# EasyEDA Pro project ProProject_keyboard_Tassel43_2024-03-30.epro, board Tassel43_Without_RGB_Left
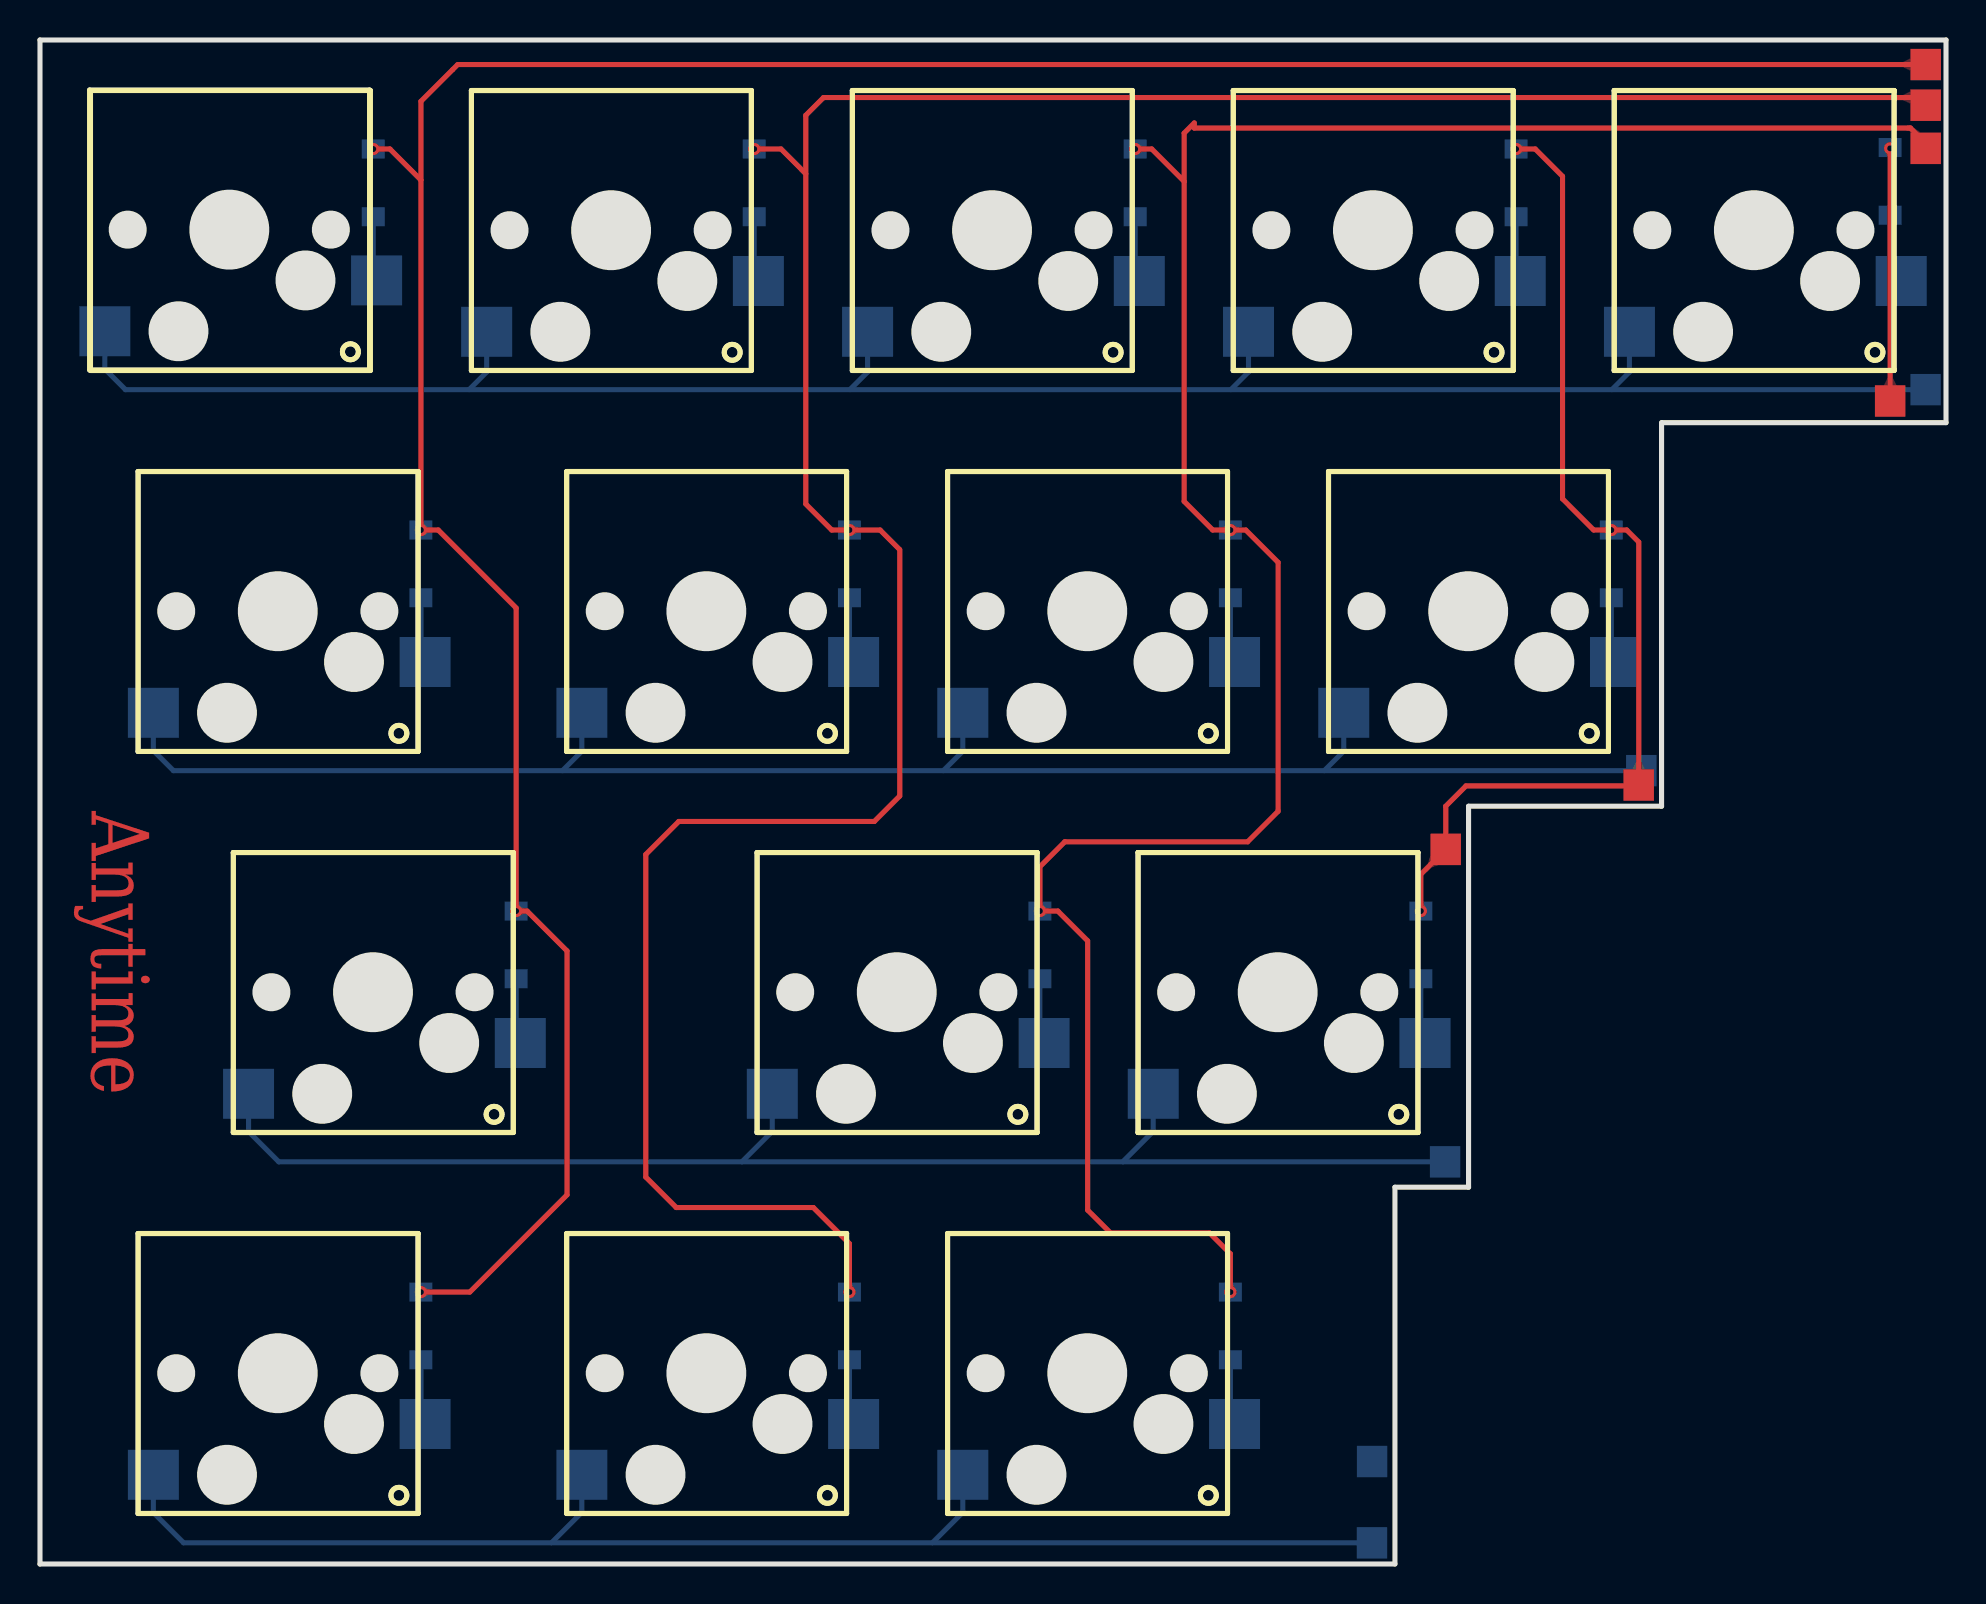
[diagram p13: board, top side]
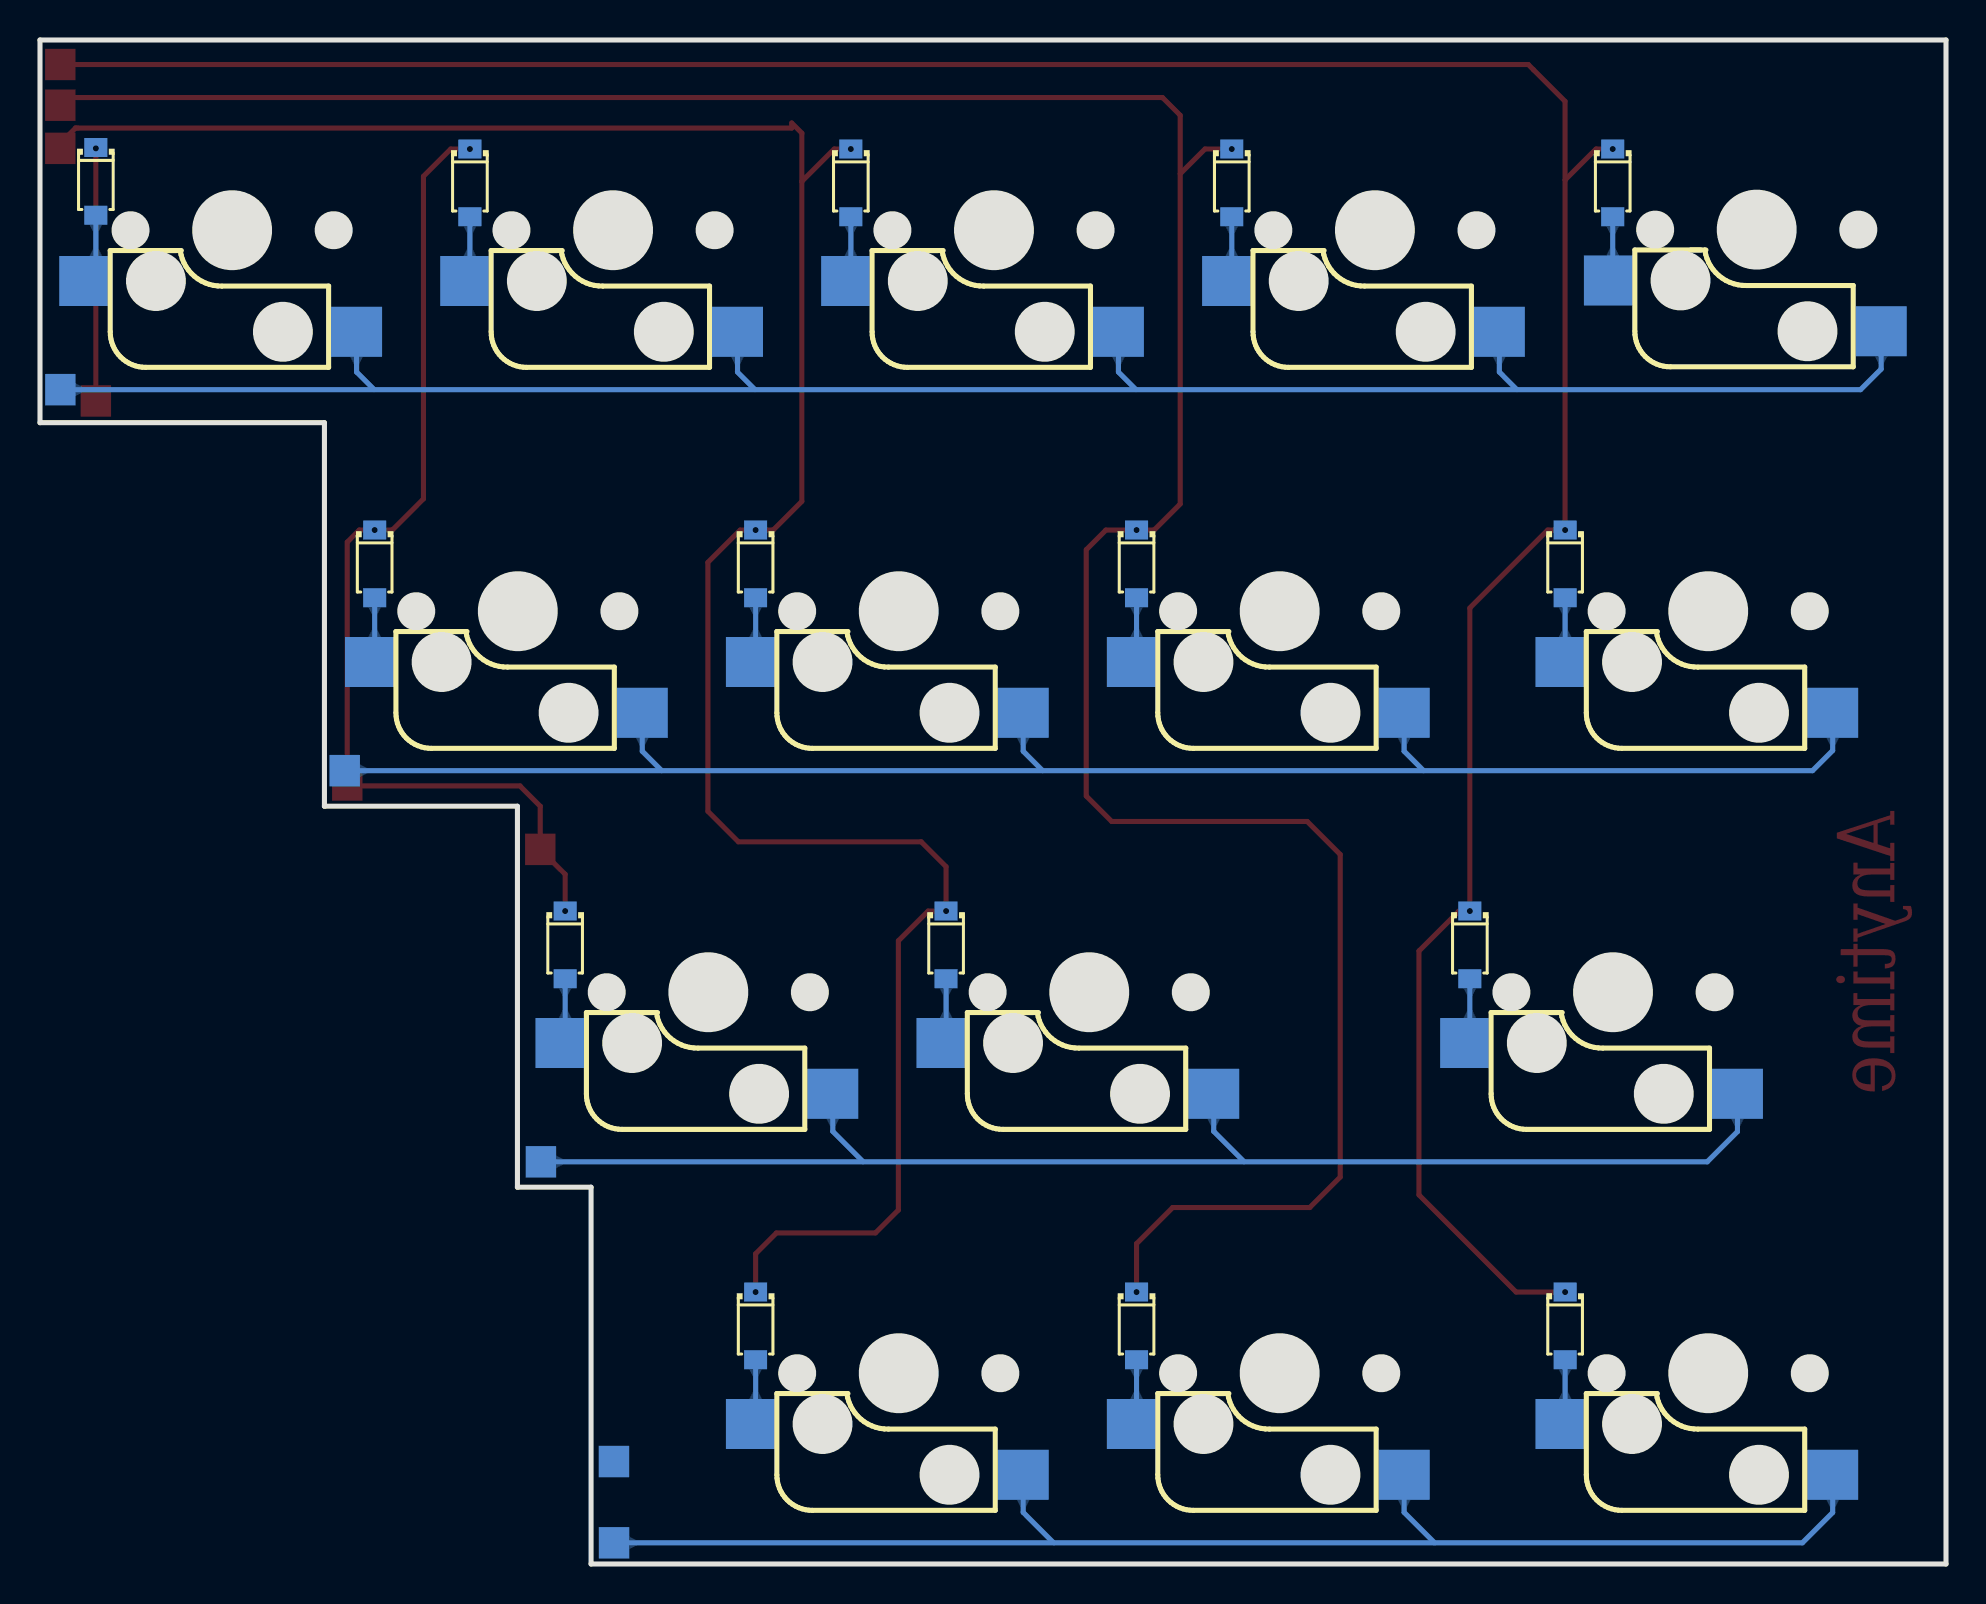
[diagram p14: board, bottom side, seen from below]

Outline 95.32 x 76.2 mm; copper layers: Top Layer, Bottom Layer. Coordinates in mm from the lower left corner of the outline.
Outline path: 0,76.2 95.32,76.2 95.32,57.07 81.09,57.07 81.09,37.89 71.44,37.89 71.44,18.84 67.76,18.84 67.76,0 0,0 0,76.2
Stack: Top Layer 0.035mm / Dielectric1 1.51mm FR4 er 4.5 / Bottom Layer 0.035mm

## Design rules (mm)
spacing Default (default): track to track 0.152, other pairs 0 to 0.152
track width Default (default): min 0.254, default 0.254, max 25.4
differential pair differentialPair (default): width min 0.127, default 0.254, max 2.54; gap min 0.152, default 0.152
via Default (default): diameter min 0.61, default 0.61, max 100.025; hole min 0.305, default 0.305, max 59.995
net GND uses gge57133(1)
pour e605 uses gge57133
pour e606 uses gge57133(1)

## Placement (name value [footprint] x y rotation side)
A  -  [凯华热插拨]  33.32 47.64 0 top
CAP  -  [凯华热插拨]  16.65 28.59 0 top
D  -  [凯华热插拨]  71.42 47.64 0 top
D14  1N4148W  [SOD-123_L2.8-W1.8-LS3.7-RD]  19.05 11.9 270 bottom
D35  1N4148W  [SOD-123_L2.8-W1.8-LS3.7-RD]  40.48 11.9 270 bottom
D41  1N4148W  [SOD-123_L2.8-W1.8-LS3.7-RD]  59.53 11.9 270 bottom
D53  1N4148W  [SOD-123_L2.8-W1.8-LS3.7-RD]  23.81 30.96 270 bottom
D54  1N4148W  [SOD-123_L2.8-W1.8-LS3.7-RD]  50.01 30.96 270 bottom
D55  1N4148W  [SOD-123_L2.8-W1.8-LS3.7-RD]  69.06 30.96 270 bottom
D64  1N4148W  [SOD-123_L2.8-W1.8-LS3.7-RD]  19.05 50.01 270 bottom
D65  1N4148W  [SOD-123_L2.8-W1.8-LS3.7-RD]  40.48 50.01 270 bottom
D66  1N4148W  [SOD-123_L2.8-W1.8-LS3.7-RD]  59.53 50.01 270 bottom
D68  1N4148W  [SOD-123_L2.8-W1.8-LS3.7-RD]  78.58 50.01 270 bottom
D83  1N4148W  [SOD-123_L2.8-W1.8-LS3.7-RD]  92.52 69.13 270 bottom
D84  1N4148W  [SOD-123_L2.8-W1.8-LS3.7-RD]  73.82 69.06 270 bottom
D85  1N4148W  [SOD-123_L2.8-W1.8-LS3.7-RD]  54.77 69.06 270 bottom
D86  1N4148W  [SOD-123_L2.8-W1.8-LS3.7-RD]  35.72 69.06 270 bottom
D87  1N4148W  [SOD-123_L2.8-W1.8-LS3.7-RD]  16.67 69.06 270 bottom
E  -  [凯华热插拨]  66.66 66.69 0 top
ESC  -  [凯华热插拨]  9.47 66.72 0 top
LCTRL  -  [凯华热插拨]  11.89 9.54 0 top
LGUI  -  [凯华热插拨]  33.32 9.54 0 top
LGUI1  -  [凯华热插拨]  52.37 9.54 0 top
NOREF  -  [Pad_e279]  94.3 58.72 0 top
NOREF#2  -  [Pad_e281]  70.27 20.11 0 top
NOREF#3  -  [Pad_e604]  70.3 35.73 0 top
NOREF#4  -  [Pad_e601]  94.3 70.78 0 top
NOREF#5  -  [Pad_e602]  92.52 58.15 0 top
NOREF#6  -  [Pad_e140]  66.62 5.12 0 top
NOREF#7  -  [Pad_e600]  94.3 72.94 0 top
NOREF#8  -  [Pad_e599]  94.3 74.97 0 top
NOREF#9  -  [Pad_e282]  66.61 1.06 0 top
NOREF#10  -  [Pad_e280]  80.08 39.67 0 top
NOREF#11  -  [Pad_e603]  79.95 38.95 0 top
Q  -  [凯华热插拨]  28.56 66.69 0 top
R  -  [凯华热插拨]  85.71 66.69 0 top
S  -  [凯华热插拨]  52.37 47.64 0 top
TAB  -  [凯华热插拨]  11.89 47.64 0 top
W  -  [凯华热插拨]  47.61 66.69 0 top
X  -  [凯华热插拨]  61.9 28.59 0 top
Z  -  [凯华热插拨]  42.85 28.59 0 top

## Footprints (pads in the part's own frame, mm; a bottom-side part is the same pattern mirrored in y, then rotated)
Pad_e140
  rect 1.52x1.57 smd far side: 22(0,0)
Pad_e279
  rect 1.52x1.57 smd far side: 14(0,0)
Pad_e280
  rect 1.52x1.57 smd far side: 21(0,0)
Pad_e281
  rect 1.52x1.57 smd far side: 22(0,0)
Pad_e282
  rect 1.52x1.57 smd far side: 24(0,0)
Pad_e599
  rect 1.52x1.57 smd: 6(0,0)
Pad_e600
  rect 1.52x1.57 smd: 7(0,0)
Pad_e601
  rect 1.52x1.57 smd: 9(0,0)
Pad_e602
  rect 1.52x1.57 smd: 16(0,0)
Pad_e603
  rect 1.52x1.57 smd: 18(0,0)
Pad_e604
  rect 1.52x1.57 smd: 26(0,0)
SOD-123_L2.8-W1.8-LS3.7-RD
  rect 0.95x1.15 smd: 1(-1.692,0) 2(1.692,0)
凯华热插拨
  rect 2.55x2.5 smd far side: K1(-6.223,-5.08) K2(7.366,-2.54)

## Nets
GND: NOREF#6.22
A1_4: A.K2 D65.2
COL0: D14.1 D53.1 D64.1 D87.1 NOREF#8.6
COL1: D35.1 D65.1 D86.1 NOREF#7.7
COL2: D41.1 D54.1 D66.1 D85.1 NOREF#4.9
COL3: D55.1 D68.1 D84.1 NOREF#3.26 NOREF#11.18
COL4: D83.1 NOREF#5.16
D14_2: D14.2 LCTRL.K2
D53_2: CAP.K2 D53.2
D64_2: D64.2 TAB.K2
D67_4: D.K2 D68.2
D83_2: D83.2 R.K2
D84_2: D84.2 E.K2
D85_2: D85.2 W.K2
D86_2: D86.2 Q.K2
ESC1_4: D87.2 ESC.K2
LALT1_4: D41.2 LGUI1.K2
LGUI1_4: D35.2 LGUI.K2
ROW0: E.K1 ESC.K1 NOREF.14 Q.K1 R.K1 W.K1
ROW1: A.K1 D.K1 NOREF#10.21 S.K1 TAB.K1
ROW2: CAP.K1 NOREF#2.22 X.K1 Z.K1
ROW3: LCTRL.K1 LGUI.K1 LGUI1.K1 NOREF#9.24
S1_4: D66.2 S.K2
X2_4: D55.2 X.K2
Z1_4: D54.2 Z.K2

## Via types
v1: diameter 0.61, hole 0.305, Top Layer to Bottom Layer, 15 vias

## Routing (per net, layer and track width the routed paths; a pad name or vN(x,y) marks a point on that pad's centre or on a via; arc(x,y) is an arc through that point)
A1_4: length 3.3
  Bottom Layer w0.254: 40.69,45.1 40.48,45.31 D65.2
COL0: length 146.9
  Top Layer w0.254: 19.05,69.2 19.05,73.13 20.89,74.97 NOREF#8.6 ; 19.05,69.2 17.5,70.75 16.67,70.75 ; 19.05,69.2 v1(19.05,51.7) 19.91,51.7 23.81,47.8 23.81,32.65 24.36,32.65 26.36,30.65 26.36,18.46 21.5,13.6 19.05,13.6
  vias: v1(16.67,70.75) v1(19.05,13.6) v1(23.81,32.65)
COL1: length 141.7
  Top Layer w0.254: 38.3,69.51 38.3,53 39.6,51.7 v1(40.48,51.7) 42.01,51.7 42.99,50.72 42.99,38.4 41.72,37.13 31.95,37.13 30.29,35.48 30.29,19.35 31.82,17.82 38.68,17.82 40.48,16.02 v1(40.48,13.6) ; 38.3,69.51 37.06,70.75 35.72,70.75 ; 38.3,69.51 38.3,72.43 39.18,73.32 ; NOREF#7.7 93.92,73.32 92.78,73.32 ; 93.41,73.32 39.18,73.32
  vias: v1(35.72,70.75)
COL2: length 119.9
  Top Layer w0.254: 57.73,72.05 57.73,71.8 93.54,71.8 ; v1(59.53,51.7) 60.3,51.7 61.92,50.08 61.92,37.64 60.39,36.11 51.25,36.11 50.01,34.87 v1(50.01,32.65) 50.9,32.65 52.39,31.16 52.39,17.7 53.54,16.55 58.49,16.55 59.53,15.51 v1(59.53,13.6) ; 93.41,71.8 93.54,71.8 ; 93.54,71.8 94.3,71.04 NOREF#4.9 ; 57.72,72.05 57.22,71.54 57.22,69.13 ; 57.22,69.13 55.6,70.75 54.77,70.75 ; 57.22,69.13 57.22,53.13 58.65,51.7 59.53,51.7
  vias: v1(54.77,70.75)
COL3: length 51.7
  Top Layer w0.254: 69.06,32.65 69.06,34.49 NOREF#3.26 70.3,37.89 71.32,38.91 79.95,38.91 ; 79.95,39.68 NOREF#11.18 ; 79.95,39.67 79.95,51.1 79.35,51.7 77.7,51.7 76.14,53.26 76.14,69.39 74.78,70.75 73.82,70.75
  vias: v1(69.06,32.65) v1(73.82,70.75) v1(78.58,51.7)
COL4: length 12.6
  Top Layer w0.254: v1(92.52,70.78) 92.52,58.15
D14_2: length 3.3
  Bottom Layer w0.254: LCTRL.K2 19.05,7.21 D14.2
D53_2: length 3.3
  Bottom Layer w0.254: 24.02,26.05 23.81,26.26 D53.2
D64_2: length 3.3
  Bottom Layer w0.254: TAB.K2 19.05,45.31 D64.2
D67_4: length 3.3
  Bottom Layer w0.254: 78.79,45.1 78.58,45.31 78.58,48.31
D83_2: length 3.5
  Bottom Layer w0.254: R.K2 92.52,64.7 92.52,67.44
D84_2: length 3.3
  Bottom Layer w0.254: 73.82,67.36 73.82,64.36 74.03,64.15
D85_2: length 3.3
  Bottom Layer w0.254: W.K2 54.77,64.36 54.77,67.36
D86_2: length 3.3
  Bottom Layer w0.254: 35.72,67.36 35.72,64.36 Q.K2
ESC1_4: length 3.3
  Bottom Layer w0.254: ESC.K2 16.67,64.34 16.67,67.36
LALT1_4: length 3.3
  Bottom Layer w0.254: 59.53,10.21 59.53,7.21 59.74,7
LGUI1_4: length 3.3
  Bottom Layer w0.254: 40.69,7 40.48,7.21 D35.2
ROW0: length 106.4
  Bottom Layer w0.254: ESC.K1 3.24,59.75 4.27,58.72 NOREF.14 ; 40.51,58.72 41.39,59.6 W.K1 ; 21.46,58.72 22.34,59.6 22.34,61.61 ; R.K1 79.49,59.6 78.61,58.72 ; 59.56,58.72 60.44,59.6 60.44,61.61
ROW1: length 86.6
  Bottom Layer w0.254: 45.18,39.67 46.15,40.64 S.K1 ; TAB.K1 5.67,40.67 6.67,39.67 NOREF#10.21 ; 26.13,39.67 27.1,40.64 A.K1 ; D.K1 65.2,40.64 64.23,39.67
ROW2: length 70.4
  Bottom Layer w0.254: 54.15,20.11 55.67,21.63 55.67,23.51 ; NOREF#2.22 11.94,20.11 10.43,21.62 CAP.K1 ; 36.62,23.51 36.62,21.63 35.1,20.11
ROW3: length 71.5
  Bottom Layer w0.254: NOREF#9.24 7.18,1.06 5.67,2.57 LCTRL.K1 ; 44.62,1.06 46.15,2.58 LGUI1.K1 ; LGUI.K1 27.1,2.58 25.58,1.06
S1_4: length 3.3
  Bottom Layer w0.254: 59.53,48.31 59.53,45.31 59.74,45.1
X2_4: length 3.3
  Bottom Layer w0.254: D55.2 69.06,26.26 X.K2
Z1_4: length 3.3
  Bottom Layer w0.254: 50.21,26.05 50,26.26 D54.2

## Copper pours and planes (outline as drawn; the poured copper is in the pictures)
GND on Top Layer: -2.85,78.4 98.75,78.4 98.75,-2.88 -2.85,-2.88
GND on Bottom Layer: -2.85,78.4 98.75,78.4 98.75,-2.88 -2.85,-2.88

Small or netless copper shapes (teardrops, artwork), in the pictures only: 27 on Top Layer, 49 on Bottom Layer

## Text on the board
Top Layer: Anytime
